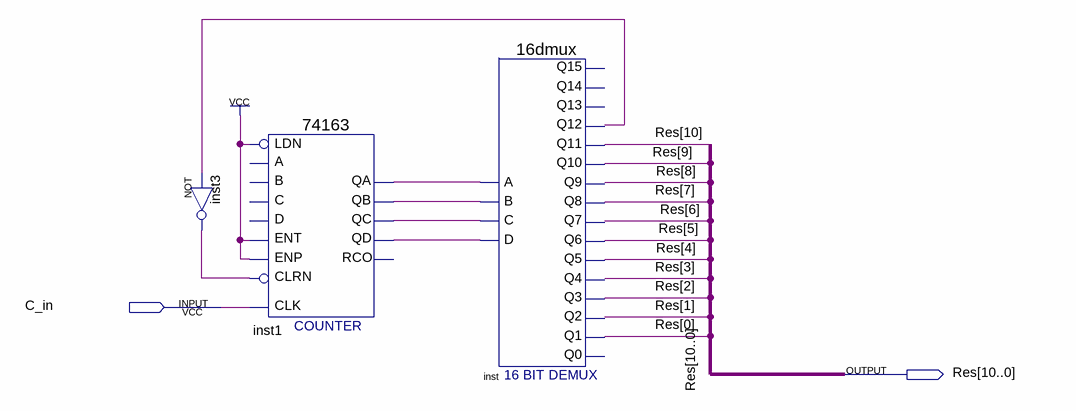
[diagram p0: schematic sheet]
// Quartus schematic DivergentBlock.bdf as structural Verilog: 3 symbols, 2 pins
module DivergentBlock (
  input  C_in,
  output [10:0] Res
);

  wire inst1_qa, inst1_qb, inst1_qc, inst1_qd, inst3_out, inst_q12;

  \74163  inst1 (
    .ENT(1'b1), .CLRN(inst3_out), .CLK(C_in), .ENP(1'b1), .LDN(1'b1), .QA(inst1_qa), .QB(inst1_qb),
    .QC(inst1_qc), .QD(inst1_qd));  // open: C, B, A, D, RCO
  not inst3 (inst3_out, inst_q12);
  \16dmux  inst (
    .C(inst1_qc), .B(inst1_qb), .A(inst1_qa), .D(inst1_qd), .Q12(inst_q12), .Q11(Res[10]), .Q9(Res[8]),
    .Q10(Res[9]), .Q7(Res[6]), .Q8(Res[7]), .Q4(Res[3]), .Q5(Res[4]), .Q6(Res[5]), .Q2(Res[1]), .Q3(Res[2]),
    .Q1(Res[0]));  // open: Q13, Q14, Q15, Q0
endmodule
